# EasyEDA schematic Apollon_TLM_testing.json
TITLE: Sheet_1; REV: 1.0; Date: 2025-12-22; Sheet: 1/1; Drawn By: arthurtouati92; Company: Your Company
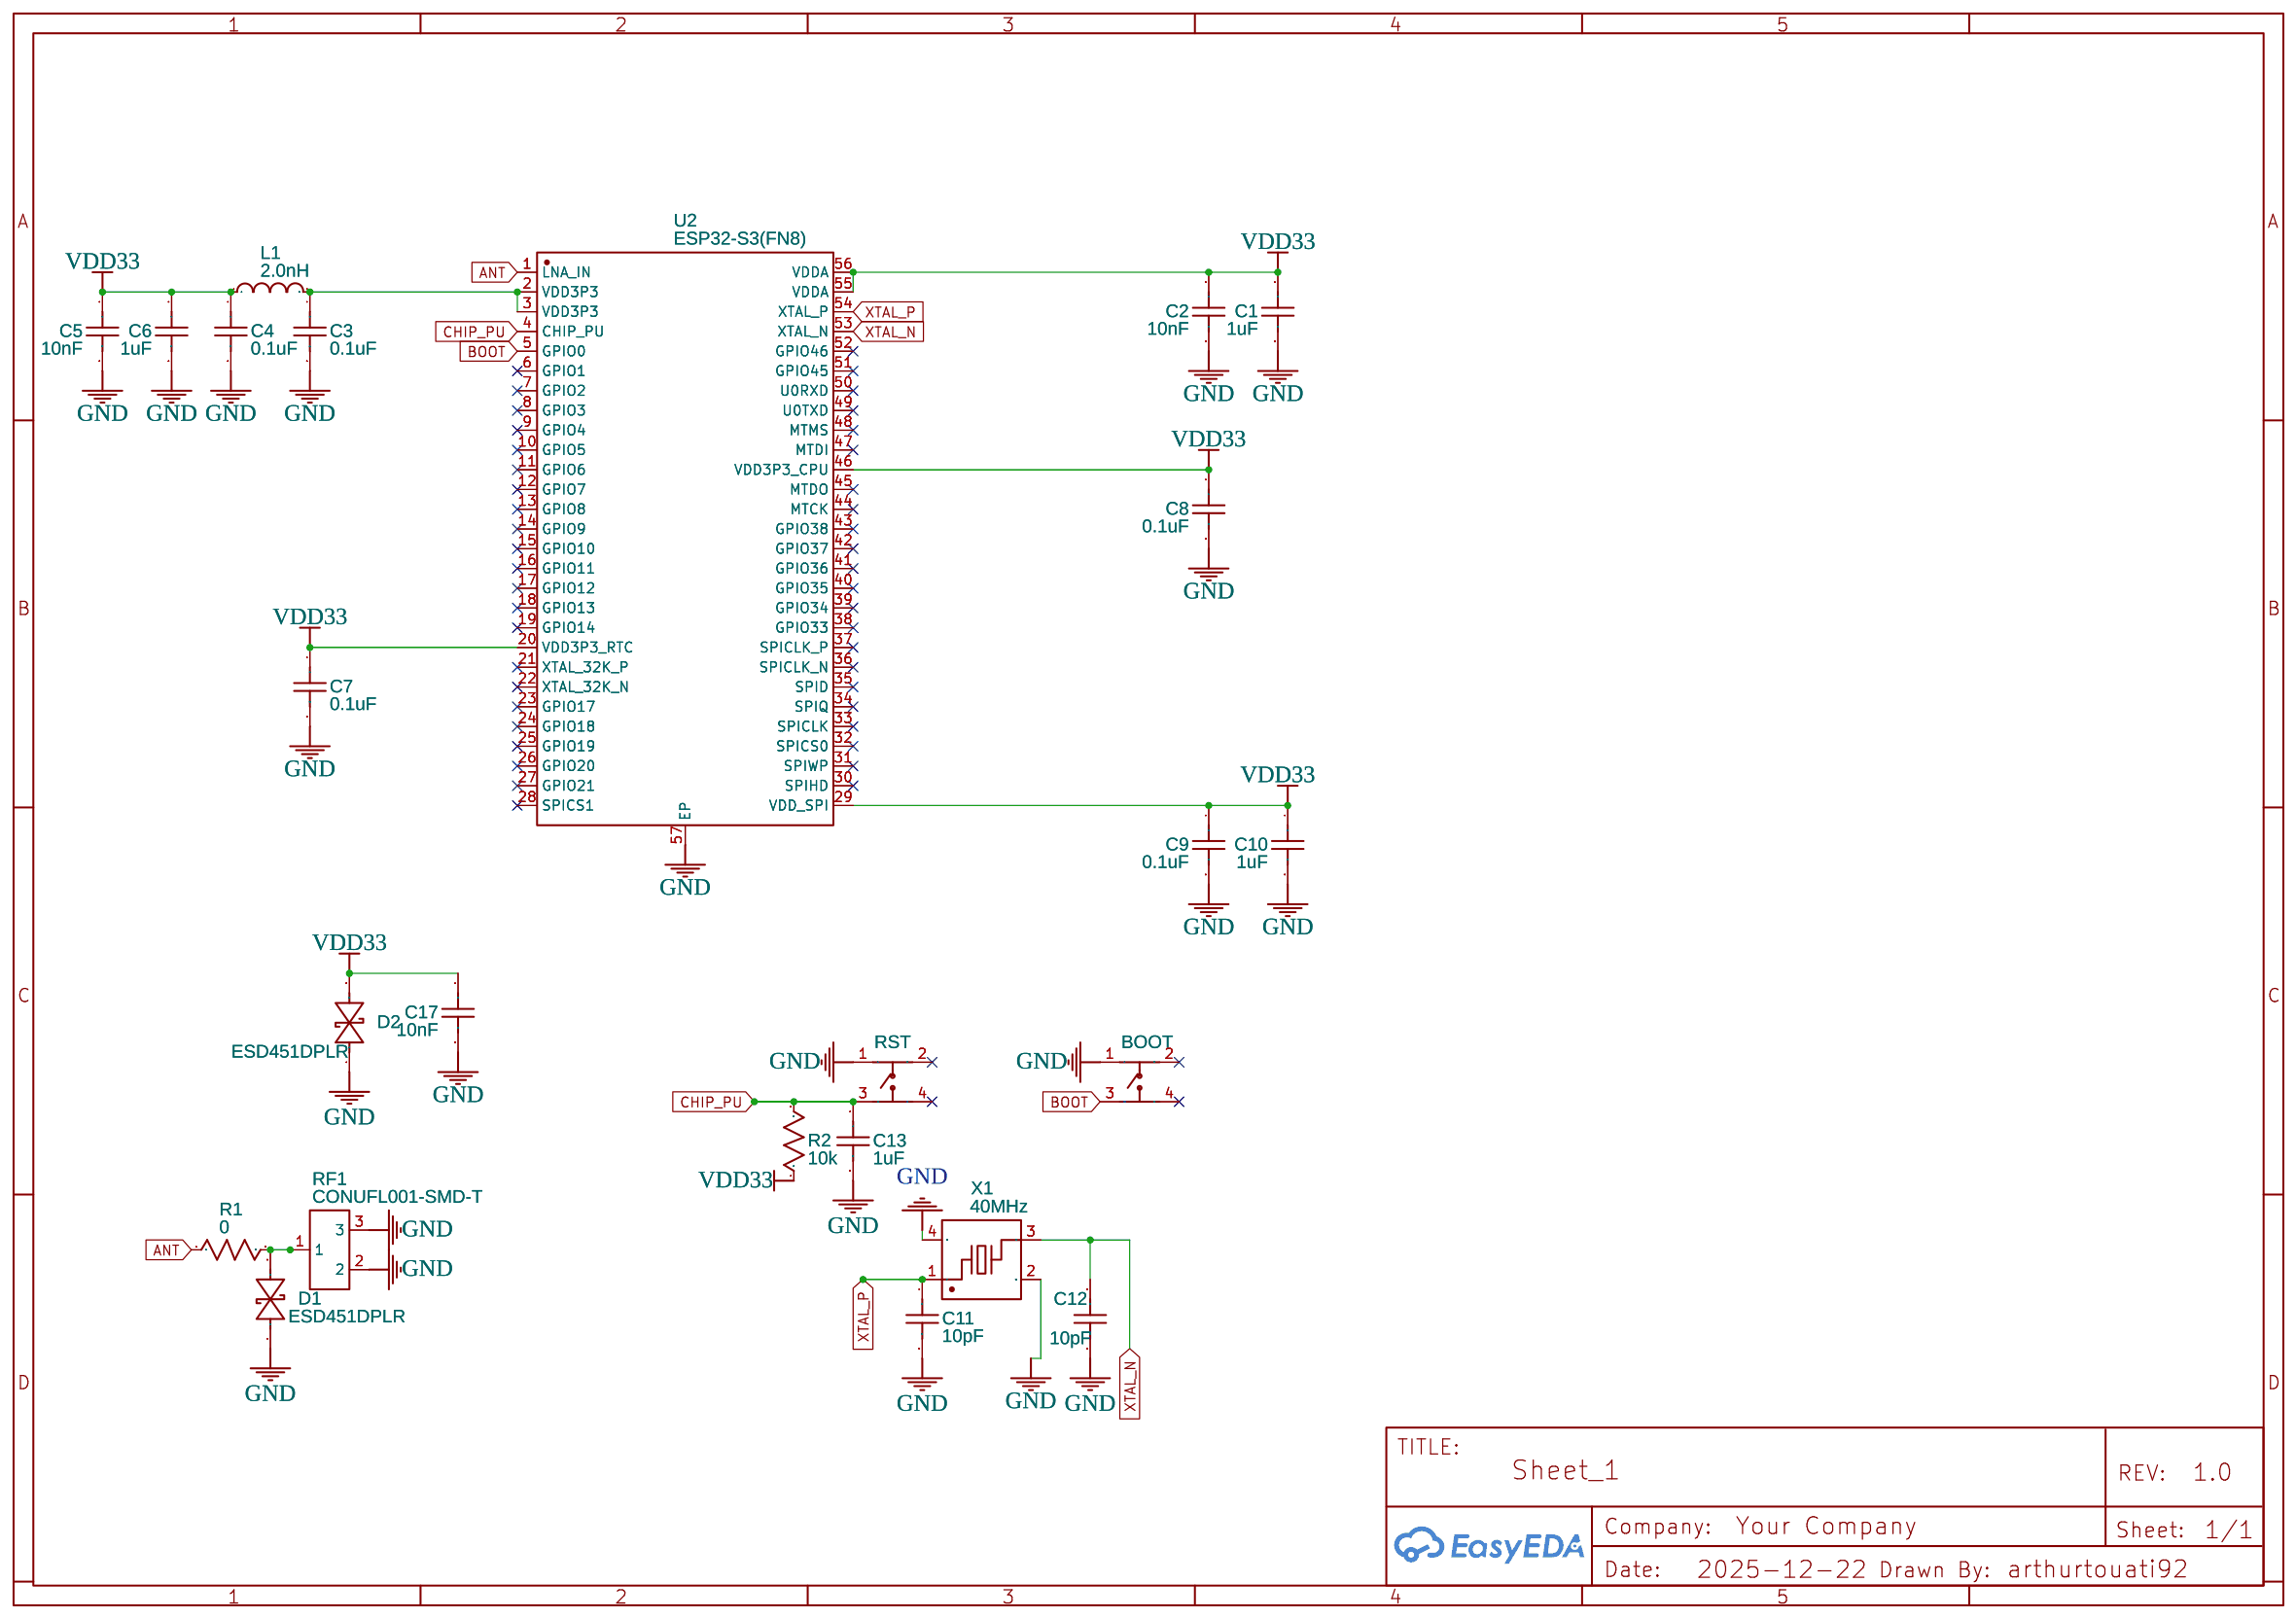
[diagram p0: schematic sheet]

## Parts
BOOT  C4B1802110  [SW-SMD_4P-L3.5-W3.0-P1.50-LS4.7]
C1  1uF  [C0402]
C2  10nF  [C0402]
C3  0.1uF  [C0402]
C4  0.1uF  [C0402]
C5  10nF  [C0402]
C6  1uF  [C0402]
C7  0.1uF  [C0402]
C8  0.1uF  [C0402]
C9  0.1uF  [C0402]
C10  1uF  [C0402]
C11  10pF  [C0402]
C12  10pF  [C0402]
C13  1uF  [C0402]
C17  10nF  [C0402]
D1  ESD451DPLR  [X2SON-2_L0.6-W0.3-P0.35_ESD441DPLR]
D2  ESD451DPLR  [X2SON-2_L0.6-W0.3-P0.35_ESD441DPLR]
L1  2.0nH  [L0402]
R1  0  [R0402]
R2  10k  [R0402]
RF1  CONUFL001-SMD-T  [IPEX-SMD_3P-L2.6-W2.6-LS3.0]
RST  C4B1802110  [SW-SMD_4P-L3.5-W3.0-P1.50-LS4.7]
U2  ESP32-S3(FN8)  [QFN-56_L7.0-W7.0-P0.40-TL-EP4.0]
X1  40MHz  [CRYSTAL-SMD_4P-L3.2-W2.5-BL]

## Library data of the parts
BOOT RST = C4B1802110: Supplier: LCSC; Supplier Part: C49393608; Manufacturer: SAMZO(三佐); JLCPCB Part Class: Extended Part; Contributor: lcsc
C1-C13 C17 = C_0402_US: Contributor: LCEDA_Lib
D1 D2 = ESD451DPLR: Supplier: LCSC; Supplier Part: C22427500; Manufacturer: TI(德州仪器); Contributor: lcsc; JLCPCB Part Class: Extended Part
L1 = L0402_US: Contributor: LCEDA_Lib
R1 R2 = R_0402_US: Contributor: LCEDA_Lib
RF1 = CONUFL001-SMD-T: Supplier: LCSC; Supplier Part: C22418213; Manufacturer: TE Connectivity(泰科电子); JLCPCB Part Class: Extended Part; Contributor: lcsc
U2 = ESP32-S3(FN8): Contributor: LCSC; Supplier: LCSC; Supplier Part: C2913196; Manufacturer: ESPRESSIF(乐鑫); Manufacturer Part: ESP32-S3FN8; JLCPCB Part Class: Extended Part
X1 = XL2EL89CPI-111YLC-40M: Supplier: LCSC; Supplier Part: C5444549; Manufacturer: YXC(扬兴晶振); Contributor: lcsc; JLCPCB Part Class: Extended Part

## Nets
GND: BOOT.1 C1.2 C2.2 C3.2 C4.2 C5.2 C6.2 C7.2 C8.2 C9.2 C10.2 C11.2 C12.2 C13.2 C17.2 D1.1 D2.1 RF1.2 RF1.3 RST.1 U2.57(EP) X1.2(GND) X1.4(GND)
VDD33: C1.1 C2.1 C4.1 C5.1 C6.1 C7.1 C8.1 C9.1 C10.1 C17.1 D2.2 L1.1 R2.1 U2.20(VDD3P3_RTC) U2.29(VDD_SPI) U2.46(VDD3P3_CPU) U2.55(VDDA) U2.56(VDDA)
ANT: R1.1 U2.1(LNA_IN)
BOOT: BOOT.3 U2.5(GPIO0)
CHIP_PU: C13.1 R2.2 RST.3 U2.4(CHIP_PU)
XTAL_N: C12.1 U2.53(XTAL_N) X1.3
XTAL_P: C11.1 U2.54(XTAL_P) X1.1
Net-(C3-1): C3.1 L1.2 U2.2(VDD3P3) U2.3(VDD3P3)
Net-(D1-2): D1.2 R1.2 RF1.1

Not connected (* = marked no-connect by the designer): BOOT 2* 4*; RST 2* 4*; U2 6(GPIO1)* 7(GPIO2)* 8(GPIO3)* 9(GPIO4)* 10(GPIO5)* 11(GPIO6)* 12(GPIO7)* 13(GPIO8)* 14(GPIO9)* 15(GPIO10)* 16(GPIO11)* 17(GPIO12)* 18(GPIO13)* 19(GPIO14)* 21(XTAL_32K_P)* 22(XTAL_32K_N)* 23(GPIO17)* 24(GPIO18)* 25(GPIO19)* 26(GPIO20)* 27(GPIO21)* 28(SPICS1)* 30(SPIHD)* 31(SPIWP)* 32(SPICS0)* 33(SPICLK)* 34(SPIQ)* 35(SPID)* 36(SPICLK_N)* 37(SPICLK_P)* 38(GPIO33)* 39(GPIO34)* 40(GPIO35)* 41(GPIO36)* 42(GPIO37)* 43(GPIO38)* 44(MTCK)* 45(MTDO)* 47(MTDI)* 48(MTMS)* 49(U0TXD)* 50(U0RXD)* 51(GPIO45)* 52(GPIO46)*
